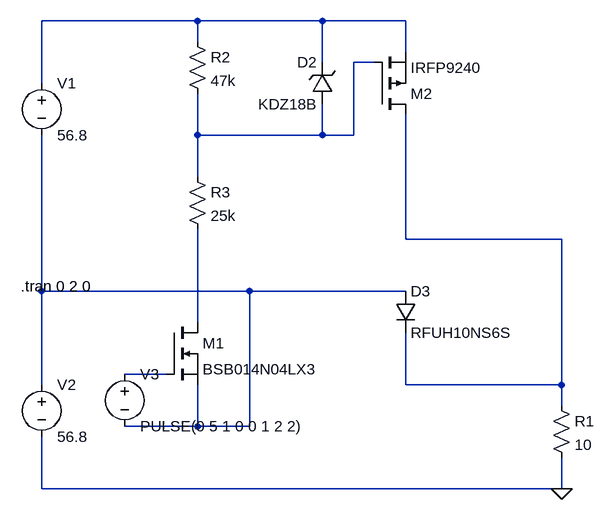
[diagram p0: schematic PSU.asc]
PSU.asc, the LTspice schematic file:
Version 4
SHEET 1 880 680
WIRE 112 -128 -128 -128
WIRE 304 -128 112 -128
WIRE 432 -128 304 -128
WIRE 112 -96 112 -128
WIRE 432 -80 432 -128
WIRE 304 -64 304 -128
WIRE 384 -64 352 -64
WIRE -128 -32 -128 -128
WIRE 112 48 112 -16
WIRE 304 48 304 0
WIRE 304 48 112 48
WIRE 352 48 352 -64
WIRE 352 48 304 48
WIRE 112 112 112 48
WIRE 432 208 432 16
WIRE 672 208 432 208
WIRE -128 288 -128 48
WIRE 192 288 -128 288
WIRE 432 288 192 288
WIRE 112 336 112 192
WIRE 64 416 0 416
WIRE -128 432 -128 288
WIRE 432 432 432 352
WIRE 672 432 672 208
WIRE 672 432 432 432
WIRE 672 464 672 432
WIRE 112 496 112 432
WIRE 112 496 0 496
WIRE 192 496 192 288
WIRE 192 496 112 496
WIRE -128 592 -128 512
WIRE 672 592 672 544
WIRE 672 592 -128 592
FLAG 672 592 0
SYMBOL res 96 -112 R0
SYMATTR InstName R2
SYMATTR Value 47k
SYMBOL voltage -128 -48 R0
WINDOW 123 0 0 Left 2
WINDOW 39 0 0 Left 2
SYMATTR InstName V1
SYMATTR Value 56.8
SYMBOL pmos 384 16 M180
SYMATTR InstName M2
SYMATTR Value IRFP9240
SYMBOL res 96 96 R0
SYMATTR InstName R3
SYMATTR Value 25k
SYMBOL zener 320 0 R180
WINDOW 0 24 64 Left 2
WINDOW 3 24 0 Left 2
SYMATTR InstName D2
SYMATTR Value KDZ18B
SYMATTR Description Diode
SYMATTR Type diode
SYMBOL voltage -128 416 R0
WINDOW 123 0 0 Left 2
WINDOW 39 0 0 Left 2
SYMATTR InstName V2
SYMATTR Value 56.8
SYMBOL diode 416 288 R0
SYMATTR InstName D3
SYMATTR Value RFUH10NS6S
SYMBOL res 656 448 R0
SYMATTR InstName R1
SYMATTR Value 10
SYMBOL nmos 64 336 R0
SYMATTR InstName M1
SYMATTR Value BSB014N04LX3
SYMBOL voltage 0 400 R0
WINDOW 123 0 0 Left 2
WINDOW 39 0 0 Left 2
SYMATTR InstName V3
SYMATTR Value PULSE(0 5 1 0 0 1 2 2)
TEXT -160 280 Left 2 !.tran 0 2 0

The netlist it stands for:
* PSU.asc
R2 N001 N002 47k
V1 N001 N004 56.8
M2 N003 N002 N001 N001 IRFP9240
R3 N002 N005 25k
D2 N002 N001 KDZ18B
V2 N004 0 56.8
D3 N004 N003 RFUH10NS6S
R1 N003 0 10
M1 N005 N006 N004 N004 BSB014N04LX3
V3 N006 N004 PULSE(0 5 1 0 0 1 2 2)
.model D D
.lib standard.dio
.model NMOS NMOS
.model PMOS PMOS
.lib standard.mos
.tran 0 2 0
.backanno
.end